# EAGLE design Audio Cape Guitar Conversion (EAGLE 6.6.0)
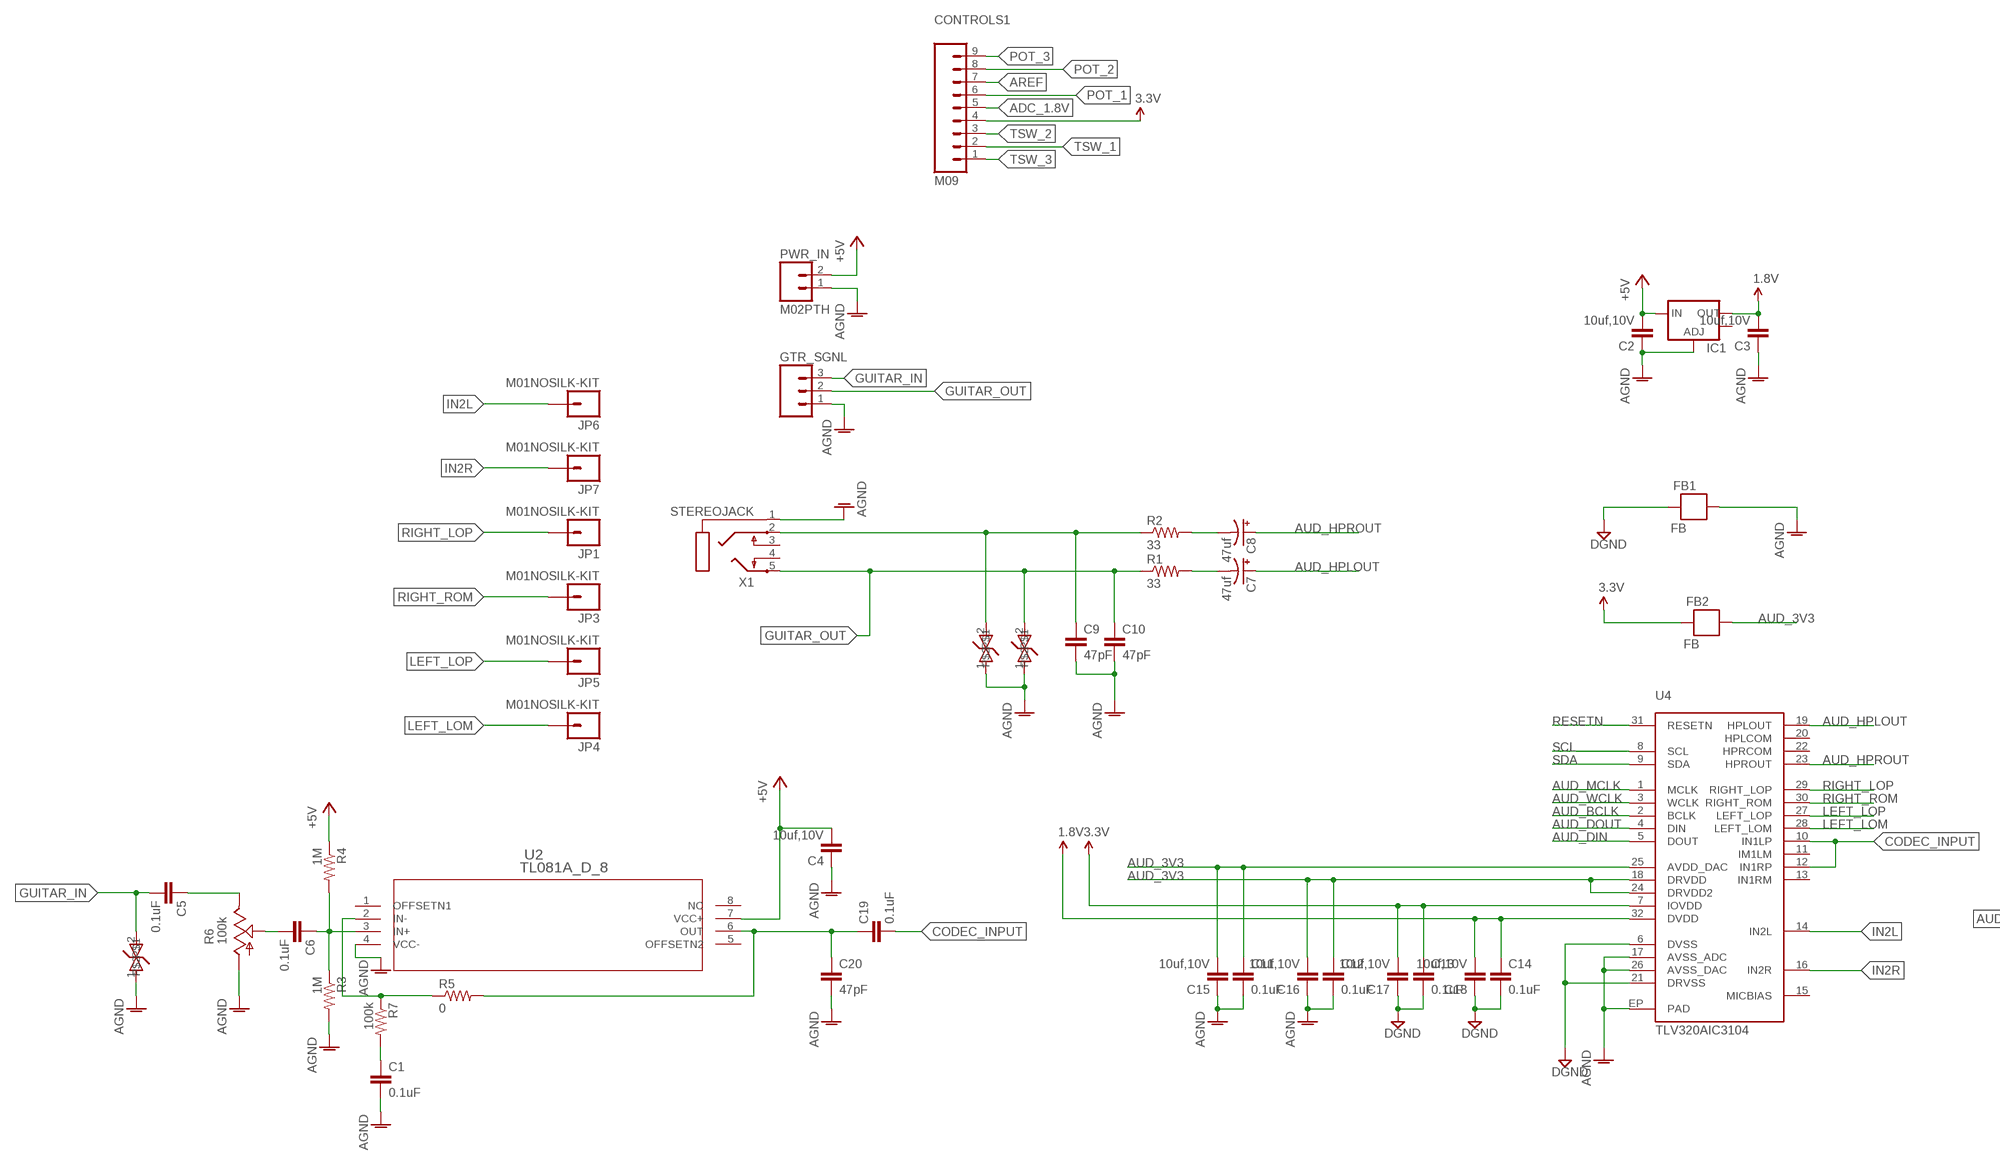
[diagram p0: schematic, sheet 1, part 1 of 2]
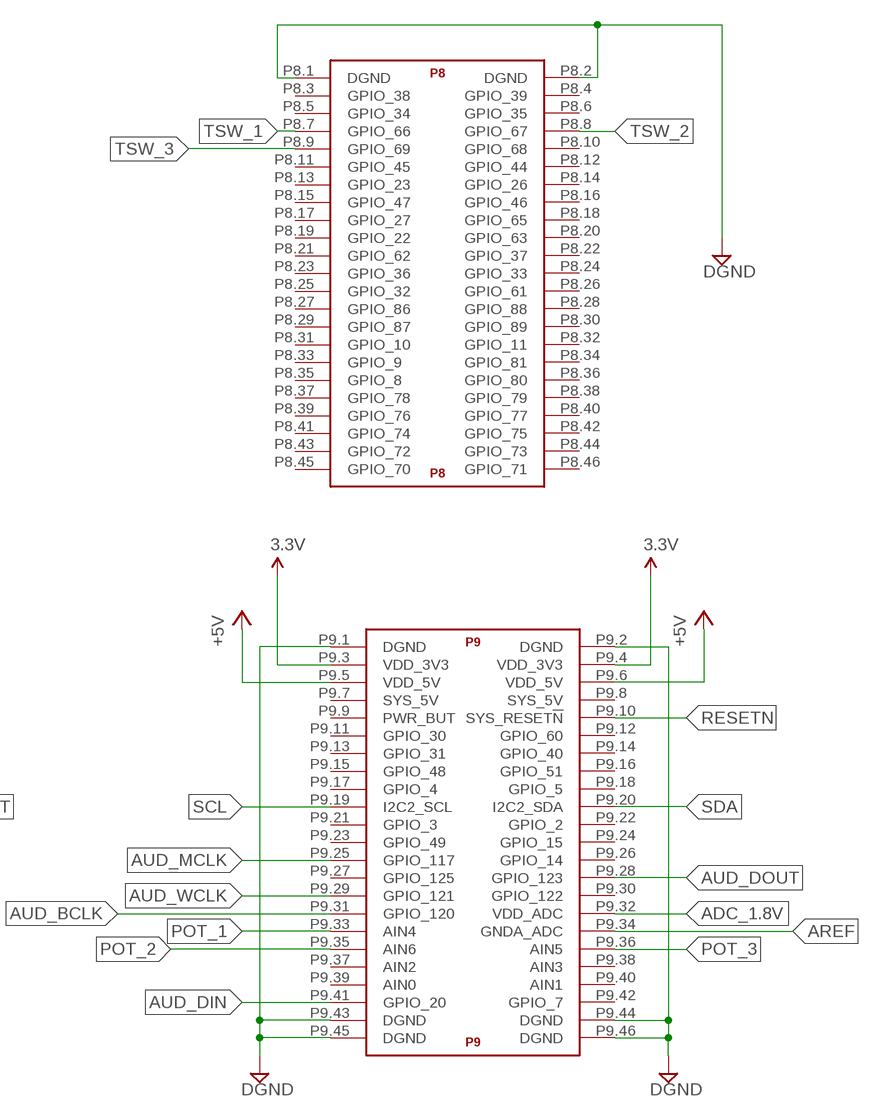
[diagram p1: schematic, sheet 1, part 2 of 2]

## Parts
C1  0.1uF  0.1UF-25V-5%(0603)  [0603-CAP]
C2  10uf,10V  CAP0603-CAP  [0603-CAP]
C3  10uf,10V  CAP0603-CAP  [0603-CAP]
C4  10uf,10V  CAP0603-CAP  [0603-CAP]
C5  0.1uF  0.1UF-25V-5%(0603)  [0603-CAP]
C6  0.1uF  0.1UF-25V-5%(0603)  [0603-CAP]
C7  47uf  CAP_POL1206  [EIA3216]
C8  47uf  CAP_POL1206  [EIA3216]
C9  47pF  CAP0402-CAP  [0402-CAP]
C10  47pF  CAP0402-CAP  [0402-CAP]
C11  0.1uF  0.1UF-25V-5%(0603)  [0603-CAP]
C12  0.1uF  0.1UF-25V-5%(0603)  [0603-CAP]
C13  0.1uF  0.1UF-25V-5%(0603)  [0603-CAP]
C14  0.1uF  0.1UF-25V-5%(0603)  [0603-CAP]
C15  10uf,10V  CAP0603-CAP  [0603-CAP]
C16  10uf,10V  CAP0603-CAP  [0603-CAP]
C17  10uf,10V  CAP0603-CAP  [0603-CAP]
C18  10uf,10V  CAP0603-CAP  [0603-CAP]
C19  0.1uF  0.1UF-25V-5%(0603)  [0603-CAP]
C20  47pF  CAP0402-CAP  [0402-CAP]
CONTROLS1  M09  [1X09]
D1  PGB0010603MR  [0603]
D2  PGB0010603MR  [0603]
D3  PGB0010603MR  [0603]
FB1  FB  [0603]
FB2  FB  [0603]
GTR_SGNL  M03PTH  [1X03]
IC1  V_REG_LM1117SOT223  [SOT223]
JP1  M01NOSILK-KIT  [1X01NS-KIT]
JP3  M01NOSILK-KIT  [1X01NS-KIT]
JP4  M01NOSILK-KIT  [1X01NS-KIT]
JP5  M01NOSILK-KIT  [1X01NS-KIT]
JP6  M01NOSILK-KIT  [1X01NS-KIT]
JP7  M01NOSILK-KIT  [1X01NS-KIT]
PWR_IN  M02PTH  [1X02]
R1  33  RESISTOR1206  [1206]
R2  33  RESISTOR1206  [1206]
R3  1M  RESISTOR1206  [1206]
R4  1M  RESISTOR1206  [1206]
R5  0  RESISTORPTH-1/4W  [AXIAL-0.4]
R6  100k  TRIM_US-S64Y  [S64Y]
R7  100k  RESISTOR1206  [1206]
U2  TL081A_D_8  [D8]
U4  TLV320AIC3104  [QFN-32]
U$1  BEAGLE_BONE_BLACK_CAPE  [BEAGLE_BONE_BLACK_CAPE]
X1  STEREOJACK  [STX3100]

## Nets
1.8V: C3.2 C14.1 C18.2 IC1.2(OUT) U4.32(DVDD)
3.3V: C13.1 C17.2 CONTROLS1.4 FB2.2 U4.7(IOVDD) U$1.P9.3(P9:VDD_3V3) U$1.P9.4(P9:VDD_3V3)
+5V: C2.2 C4.2 IC1.3(IN) PWR_IN.2 R4.1 U2.7(VCC+) U$1.P9.5(P9:VDD_5V) U$1.P9.6(P9:VDD_5V)
ADC_1.8V: CONTROLS1.5 U$1.P9.32(P9:VDD_ADC)
AGND: C1.2 C2.1 C3.1 C4.1 C9.2 C10.2 C11.2 C12.2 C15.1 C16.1 C20.2 D1.1 D2.1 D3.1 FB1.1 GTR_SGNL.1 IC1.1(ADJ) PWR_IN.1 R3.2 R6.A U2.4(VCC-) U4.17(AVSS_ADC) U4.26(AVSS_DAC) U4.EP(PAD) X1.1
AREF: CONTROLS1.7 U$1.P9.34(P9:GNDA_ADC)
AUD_3V3: C11.1 C12.1 C15.2 C16.2 FB2.1 U4.18(DRVDD) U4.24(DRVDD2) U4.25(AVDD_DAC)
AUD_BCLK: U4.2(BCLK) U$1.P9.31(P9:GPIO_120)
AUD_DIN: U4.5(DOUT) U$1.P9.41(P9:GPIO_20)
AUD_DOUT: U4.4(DIN) U$1.P9.28(P9:GPIO_123)
AUD_HPLOUT: C7.A(+) U4.19(HPLOUT)
AUD_HPROUT: C8.A(+) U4.23(HPROUT)
AUD_MCLK: U4.1(MCLK) U$1.P9.25(P9:GPIO_117)
AUD_WCLK: U4.3(WCLK) U$1.P9.29(P9:GPIO_121)
CODEC_INPUT: C19.2 U4.10(IN1LP) U4.12(IN1RP)
DGND: C13.2 C14.2 C17.1 C18.1 FB1.2 U4.6(DVSS) U4.21(DRVSS) U$1.P8.1(P8:DGND) U$1.P8.2(P8:DGND) U$1.P9.1(P9:DGND) U$1.P9.2(P9:DGND) U$1.P9.43(P9:DGND) U$1.P9.44(P9:DGND) U$1.P9.45(P9:DGND) U$1.P9.46(P9:DGND)
GUITAR_IN: C5.2 D3.2 GTR_SGNL.3
GUITAR_OUT: C10.1 D2.2 GTR_SGNL.2 R1.1 X1.5
IN2L: JP6.1 U4.14(IN2L)
IN2R: JP7.1 U4.16(IN2R)
LEFT_LOM: JP4.1 U4.28(LEFT_LOM)
LEFT_LOP: JP5.1 U4.27(LEFT_LOP)
N$1: C7.C(-) R1.2
N$2: C5.1 R6.E
N$4: C6.1 R3.1 R4.2 U2.3(IN+)
N$5: C1.1 R7.2
N$6: C8.C(-) R2.2
N$7: R5.P$1 R7.1 U2.2(IN-)
N$8: C19.1 C20.1 R5.P$2 U2.6(OUT)
N$78: C6.2 R6.S
OUTR: C9.1 D1.2 R2.1 X1.2
POT_1: CONTROLS1.6 U$1.P9.33(P9:AIN4)
POT_2: CONTROLS1.8 U$1.P9.35(P9:AIN6)
POT_3: CONTROLS1.9 U$1.P9.36(P9:AIN5)
RESETN: U4.31(RESETN) U$1.P9.10(P9:SYS_RESET!N)
RIGHT_LOP: JP1.1 U4.29(RIGHT_LOP)
RIGHT_ROM: JP3.1 U4.30(RIGHT_ROM)
SCL: U4.8(SCL) U$1.P9.19(P9:I2C2_SCL)
SDA: U4.9(SDA) U$1.P9.20(P9:I2C2_SDA)
TSW_1: CONTROLS1.2 U$1.P8.7(P8:GPIO_66)
TSW_2: CONTROLS1.3 U$1.P8.8(P8:GPIO_67)
TSW_3: CONTROLS1.1 U$1.P8.9(P8:GPIO_69)
Unconnected: IC1.4(OUT) U2.1(OFFSETN1) U2.5(OFFSETN2) U2.8(NC) U4.11(IM1LM) U4.13(IN1RM) U4.15(MICBIAS) U4.20(HPLCOM) U4.22(HPRCOM) U$1.P8.3(P8:GPIO_38) U$1.P8.4(P8:GPIO_39) U$1.P8.5(P8:GPIO_34) U$1.P8.6(P8:GPIO_35) U$1.P8.10(P8:GPIO_68) U$1.P8.11(P8:GPIO_45) U$1.P8.12(P8:GPIO_44) U$1.P8.13(P8:GPIO_23) U$1.P8.14(P8:GPIO_26) U$1.P8.15(P8:GPIO_47) U$1.P8.16(P8:GPIO_46) U$1.P8.17(P8:GPIO_27) U$1.P8.18(P8:GPIO_65) U$1.P8.19(P8:GPIO_22) U$1.P8.20(P8:GPIO_63) U$1.P8.21(P8:GPIO_62) U$1.P8.22(P8:GPIO_37) U$1.P8.23(P8:GPIO_36) U$1.P8.24(P8:GPIO_33) U$1.P8.25(P8:GPIO_32) U$1.P8.26(P8:GPIO_61) U$1.P8.27(P8:GPIO_86) U$1.P8.28(P8:GPIO_88) U$1.P8.29(P8:GPIO_87) U$1.P8.30(P8:GPIO_89) U$1.P8.31(P8:GPIO_10) U$1.P8.32(P8:GPIO_11) U$1.P8.33(P8:GPIO_9) U$1.P8.34(P8:GPIO_81) U$1.P8.35(P8:GPIO_8) U$1.P8.36(P8:GPIO_80) U$1.P8.37(P8:GPIO_78) U$1.P8.38(P8:GPIO_79) U$1.P8.39(P8:GPIO_76) U$1.P8.40(P8:GPIO_77) U$1.P8.41(P8:GPIO_74) U$1.P8.42(P8:GPIO_75) U$1.P8.43(P8:GPIO_72) U$1.P8.44(P8:GPIO_73) U$1.P8.45(P8:GPIO_70) U$1.P8.46(P8:GPIO_71) U$1.P9.7(P9:SYS_5V) U$1.P9.8(P9:SYS_5V) U$1.P9.9(P9:PWR_BUT) U$1.P9.11(P9:GPIO_30) U$1.P9.12(P9:GPIO_60) U$1.P9.13(P9:GPIO_31) U$1.P9.14(P9:GPIO_40) U$1.P9.15(P9:GPIO_48) U$1.P9.16(P9:GPIO_51) U$1.P9.17(P9:GPIO_4) U$1.P9.18(P9:GPIO_5) U$1.P9.21(P9:GPIO_3) U$1.P9.22(P9:GPIO_2) U$1.P9.23(P9:GPIO_49) U$1.P9.24(P9:GPIO_15) U$1.P9.26(P9:GPIO_14) U$1.P9.27(P9:GPIO_125) U$1.P9.30(P9:GPIO_122) U$1.P9.37(P9:AIN2) U$1.P9.38(P9:AIN3) U$1.P9.39(P9:AIN0) U$1.P9.40(P9:AIN1) U$1.P9.42(P9:GPIO_7) X1.3 X1.4

## Library data of the parts
C1 C5 C6 = SparkFun-Capacitors:0.1UF-25V-5%(0603): CAP-08604; PROD_ID: CAP-08604
C2-C4 C15-C18 = SparkFun-Passives:CAP: Capacitor Standard 0603 ceramic capacitor, and 0.1" leaded capacitor.; MANEX: 123-0001127
C7 C8 = SparkFun-Capacitors:CAP_POL: Capacitor Polarized These are standard SMD and PTH capacitors. Normally 10uF, 47uF, and 100uF in electrolytic and tantalum varieties. Always verify the external diameter of the through hole cap, it varies with capacity, voltage, and manufacturer. The EIA devices should be standard.; MANEX: 123-0001196
C9 C10 C20 = SparkFun-Passives:CAP: Capacitor Standard 0603 ceramic capacitor, and 0.1" leaded capacitor.; MANEX: 123-0001115
C11-C14 = SparkFun-Capacitors:0.1UF-25V-5%(0603): CAP-08604; MANEX: 123-0001056; PROD_ID: CAP-08604
C19 = SparkFun-Capacitors:0.1UF-25V-5%(0603): CAP-08604; MANEX: 123-0001032; PROD_ID: CAP-08604
CONTROLS1 = SparkFun-Connectors:M09: Header 9 Standard 9-pin 0.1" header. Use with straight break away headers (SKU : PRT-00116), right angle break away headers (PRT-00553), swiss pins (PRT-00743), machine pins (PRT-00117), and female headers (PRT-00115).
D1-D3 = CircuitCo:PGB0010603MR; MANEX: 130-0001371
FB1 FB2 = SparkFun-Passives:FB; MANEX: 126-0001418
GTR_SGNL = SparkFun-Connectors:M03: Header 3 Standard 3-pin 0.1" header. Use with straight break away headers (SKU : PRT-00116), right angle break away headers (PRT-00553), swiss pins (PRT-00743), machine pins (PRT-00117), and female headers (PRT-00115). Molex polarized connector foot print use with SKU : PRT-08232 with associated crimp pins and housings.
IC1 = SparkFun-PowerIC:V_REG_LM1117: Voltage Regulator LM1117 Standard adjustable voltage regulator but in SMD form. Spark Fun Electronics SKU : COM-00595
JP1 JP3-JP7 = SparkFun-Connectors:M01: Header 1 Standard 1-pin 0.1" header. Use with straight break away headers (SKU : PRT-00116), right angle break away headers (PRT-00553), swiss pins (PRT-00743), machine pins (PRT-00117), and female headers (PRT-00115).
PWR_IN = SparkFun-Connectors:M02: Standard 2-pin 0.1" header. Use with - straight break away headers ( PRT-00116) - right angle break away headers (PRT-00553) - swiss pins (PRT-00743) - machine pins (PRT-00117) - female headers (PRT-00115) Molex polarized connector foot print use with: PRT-08233 with associated crimp pins and housings. 2.54_SCREWTERM for use with PRT-10571. 3.5mm Screw Terminal footprints for PRT-08084 5mm Screw Terminal footprints for use with PRT-08432
R1 R2 = SparkFun-Resistors:RESISTOR: Resistor Basic schematic elements and footprints for 0603, 1206, and PTH resistors.; MANEX: 110-0002014
R3 R4 R7 = SparkFun-Resistors:RESISTOR: Resistor Basic schematic elements and footprints for 0603, 1206, and PTH resistors.
R5 = SparkFun-Passives:RESISTOR: Resistor Basic schematic elements and footprints for 0603, 1206, and PTH resistors.
R6 = pot:TRIM_US-: POTENTIOMETER
U2 = TL081A:TL081A_D_8; DATASHEETURL: http://www.ti.com/lit/gpn/TL081A; DESCRIPTION: JFET-Input Operational Amplifier; FAMILY_NAME: STANDARD LINEAR AMPLIFIER; GENERIC_PART_NUMBER: TL081A; INDUSTRY_STD_PKG_TYPE: SOIC; MANUFACTURER: Texas Instruments; MANUFACTURER_PART_NUMBER: tl081a_d_8; PACKAGE_DESIGNATOR: D; PIN_COUNT: 8; VENDOR: Texas Instruments
U4 = CircuitCo:TLV320AIC3104; MANEX: 140-0004277
U$1 = SparkFun-Boards:BEAGLE_BONE_BLACK_CAPE
X1 = adafruit:STEREOJACK: MIC/HEADPHONE JACK Stereo jack with two switches. Kycon STX3100, CUI SJ1-3555NG and/or 4UCon 05544

## Board
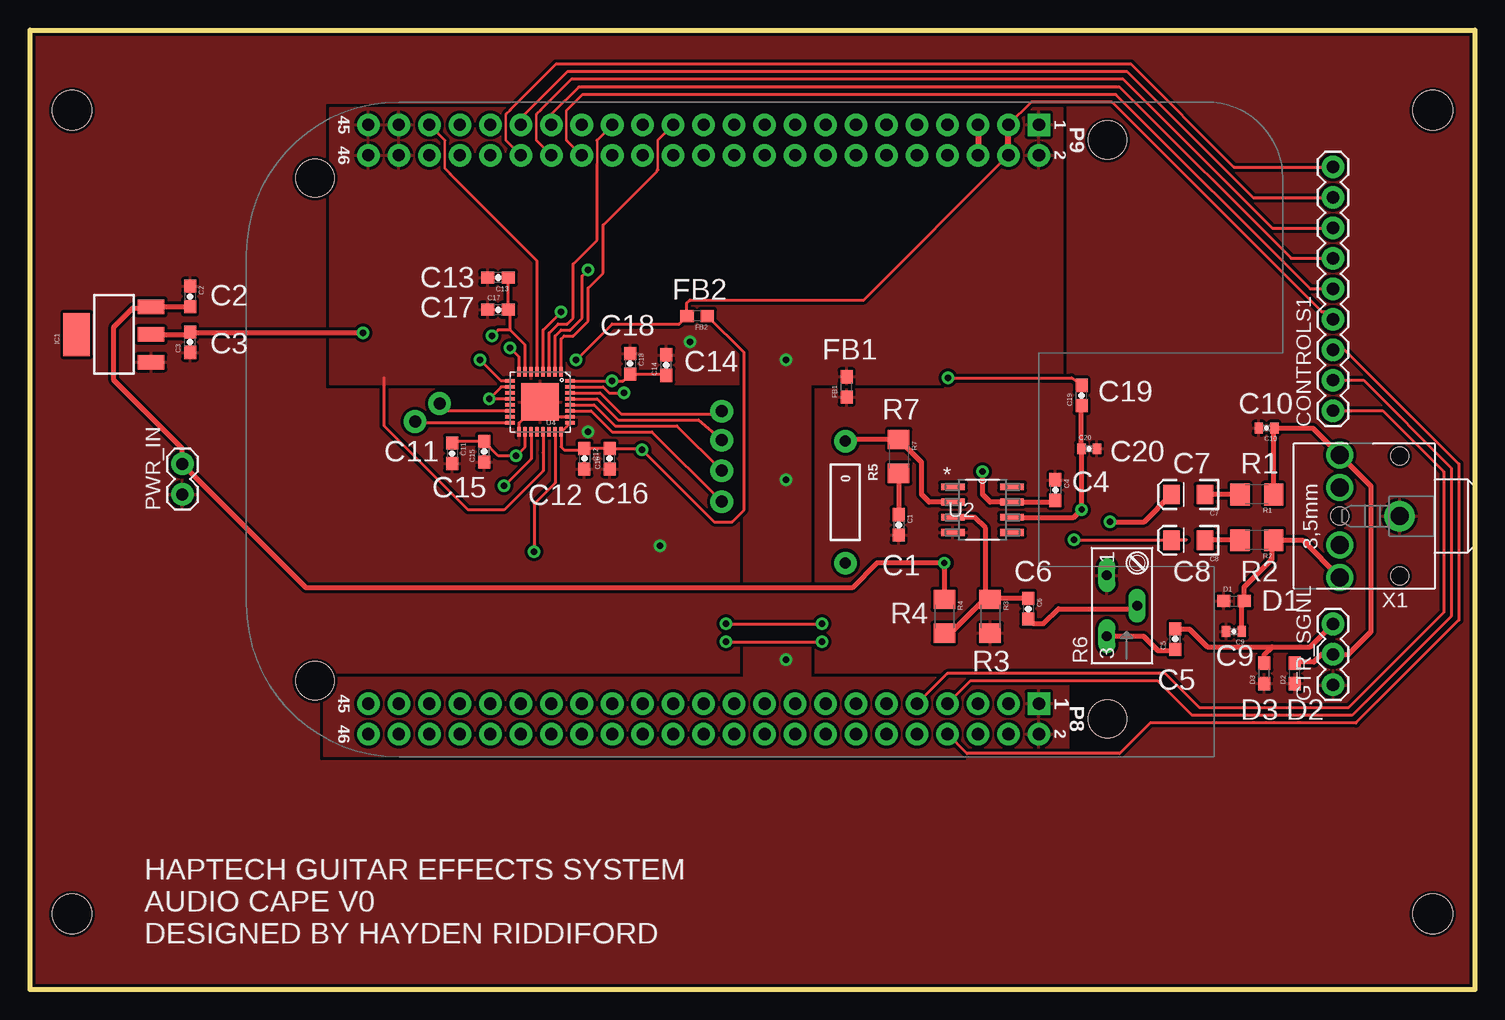
[diagram p2: board, top side]
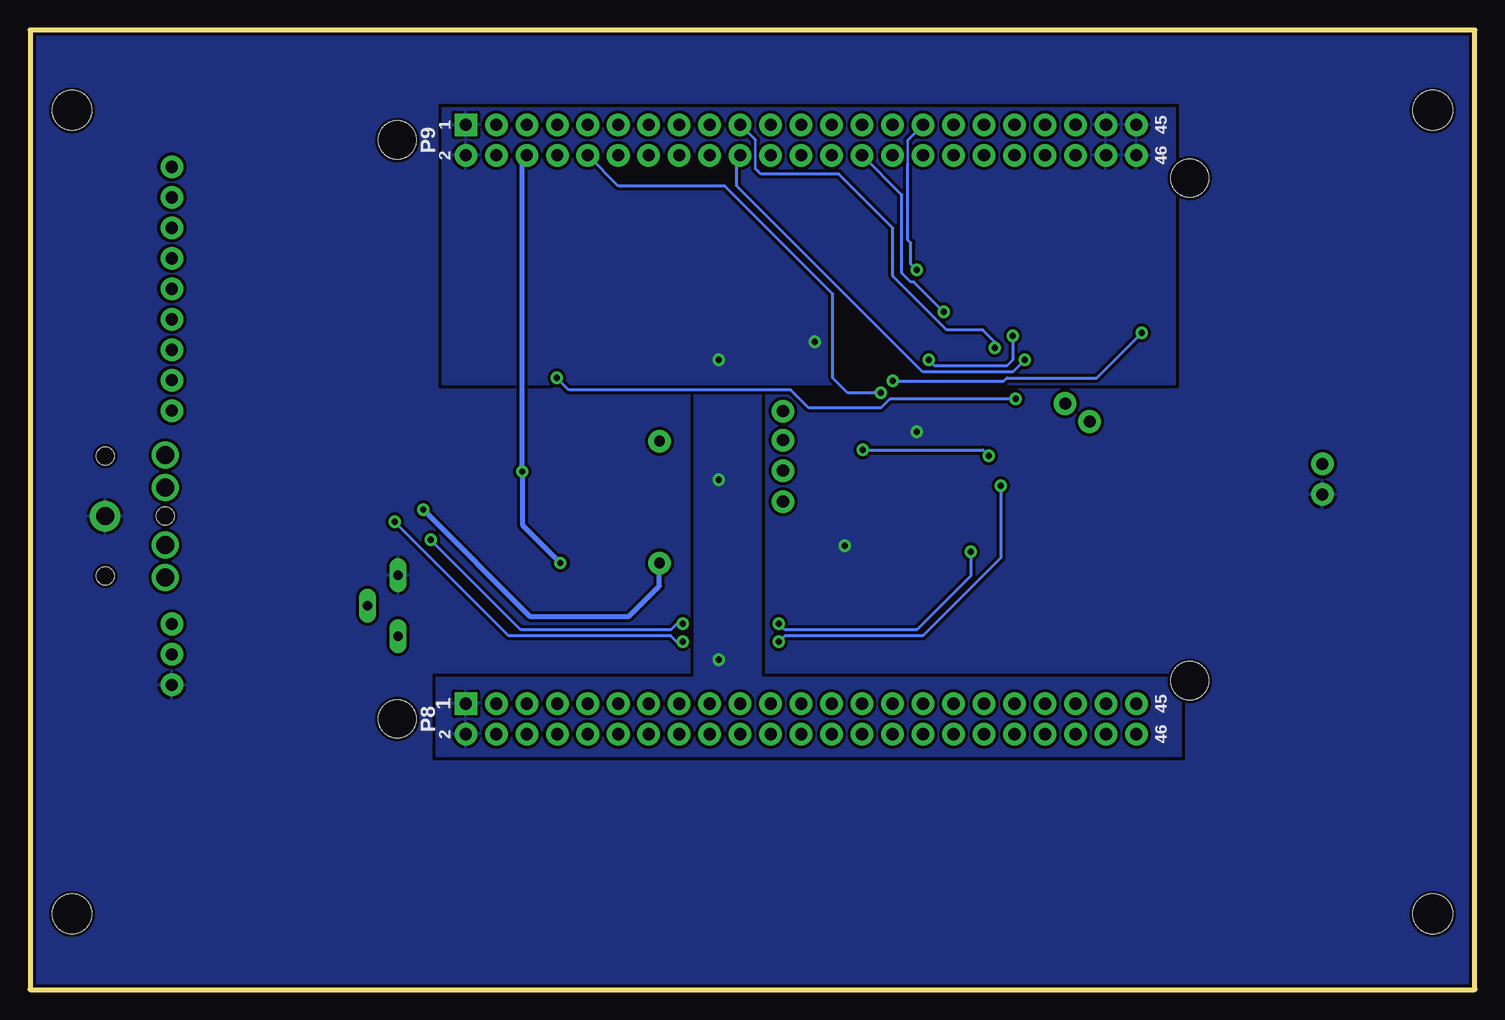
[diagram p3: board, bottom side, seen from below]

Size 120.4 x 80 mm. Coordinates in mm from the lower left corner, seen from the top.
Outline: 0,0 0,80 120.4,80 120.4,0 0,0
Copper layers (1*16): Top 0.035mm / dielectric 1.5mm / Bottom 0.035mm
Design rules "SparkFun": minimum track width 8mil, minimum drill 20mil, track to track 8mil, track to pad 8mil, pad to pad 8mil, via to via 8mil, smd to smd 8mil, copper to edge 10mil, drill to drill 8mil, minimum pad ring 12mil, minimum via ring 10mil, stop-mask expansion 4mil, vias tented up to drill 25mil, thermal gap 10mil
Holes 3.3 mm at 116.9,73.3 3.5,73.3 116.9,6.3 3.5,6.3

### Footprints (pad centres in the part's own frame; a part is rotated, then mirrored left to right if it is on the bottom)
0603-CAP = smd 1.1 x 1: 1 -0.85,0; 2 0.85,0
EIA3216 = smd 1.4 x 1.6: A 1.4,0; C -1.4,0
0402-CAP = smd 0.7 x 0.9: 1 -0.65,0; 2 0.65,0
1X09 = drill 1.016 pad 1.88: 1 0,0; 2 2.54,0; 3 5.08,0; 4 7.62,0; 5 10.16,0; 6 12.7,0; 7 15.24,0; 8 17.78,0; 9 20.32,0
0603 = smd 1.1 x 1: 1 -0.85,0; 2 0.85,0
1X03 = drill 1.016 pad 1.88: 1 0,0; 2 2.54,0; 3 5.08,0
SOT223 = smd 1.219 x 2.235: 1 -2.311,-3.099; 2 0,-3.099; 3 2.311,-3.099 | smd 3.6 x 2.2: 4 0,3.099
1X01NS-KIT = drill 1.016 pad 1.88: 1 0,0
1X02 = drill 1.016 pad 1.88: 1 0,0; 2 2.54,0
1206 = smd 1.6 x 1.8: 1 -1.4,0; 2 1.4,0
AXIAL-0.4 = drill 0.9 pad 1.88: P$1 -5.08,0; P$2 5.08,0
S64Y = drill 0.813 long: A 2.54,1.27; E -2.54,1.27; S 0,-1.27
D8 = smd 1.981 x 0.559: 1 -2.464,1.905; 2 -2.464,0.635; 3 -2.464,-0.635; 4 -2.464,-1.905; 5 2.464,-1.905; 6 2.464,-0.635; 7 2.464,0.635; 8 2.464,1.905
QFN-32 = smd 0.285 x 0.8: 1 -1.75,-2.5; 2 -1.25,-2.5; 3 -0.75,-2.5; 4 -0.25,-2.5; 5 0.25,-2.5; 6 0.75,-2.5; 7 1.25,-2.5; 8 1.75,-2.5; 17 1.75,2.5; 18 1.25,2.5; 19 0.75,2.5; 20 0.25,2.5; 21 -0.25,2.5; 22 -0.75,2.5; 23 -1.25,2.5; 24 -1.75,2.5 | smd 0.8 x 0.285: 9 2.5,-1.75; 10 2.5,-1.25; 11 2.5,-0.75; 12 2.5,-0.25; 13 2.5,0.25; 14 2.5,0.75; 15 2.5,1.25; 16 2.5,1.75; 25 -2.5,1.75; 26 -2.5,1.25; 27 -2.5,0.75; 28 -2.5,0.25; 29 -2.5,-0.25; 30 -2.5,-0.75; 31 -2.5,-1.25; 32 -2.5,-1.75 | smd 3.15 x 3.15: EP 0,0
BEAGLE_BONE_BLACK_CAPE = drill 1.016 pad 1.88 square: P8.1 20.32,50.165; P9.1 20.32,1.905 | drill 1.016 pad 1.88: P8.2 20.32,52.705; P8.3 22.86,50.165; P8.4 22.86,52.705; P8.5 25.4,50.165; P8.6 25.4,52.705; P8.7 27.94,50.165; P8.8 27.94,52.705; P8.9 30.48,50.165; P8.10 30.48,52.705; P8.11 33.02,50.165; P8.12 33.02,52.705; P8.13 35.56,50.165; P8.14 35.56,52.705; P8.15 38.1,50.165; P8.16 38.1,52.705; P8.17 40.64,50.165; P8.18 40.64,52.705; P8.19 43.18,50.165; P8.20 43.18,52.705; P8.21 45.72,50.165; P8.22 45.72,52.705; P8.23 48.26,50.165; P8.24 48.26,52.705; P8.25 50.8,50.165; P8.26 50.8,52.705; P8.27 53.34,50.165; P8.28 53.34,52.705; P8.29 55.88,50.165; P8.30 55.88,52.705; P8.31 58.42,50.165; P8.32 58.42,52.705; P8.33 60.96,50.165; P8.34 60.96,52.705; P8.35 63.5,50.165; P8.36 63.5,52.705; P8.37 66.04,50.165; P8.38 66.04,52.705; P8.39 68.58,50.165; P8.40 68.58,52.705; P8.41 71.12,50.165; P8.42 71.12,52.705; P8.43 73.66,50.165; P8.44 73.66,52.705; P8.45 76.2,50.165; P8.46 76.2,52.705; P9.2 20.32,4.445; P9.3 22.86,1.905; P9.4 22.86,4.445; P9.5 25.4,1.905; P9.6 25.4,4.445; P9.7 27.94,1.905; P9.8 27.94,4.445; P9.9 30.48,1.905; P9.10 30.48,4.445; P9.11 33.02,1.905; P9.12 33.02,4.445; P9.13 35.56,1.905; P9.14 35.56,4.445; P9.15 38.1,1.905; P9.16 38.1,4.445; P9.17 40.64,1.905; P9.18 40.64,4.445; P9.19 43.18,1.905; P9.20 43.18,4.445; P9.21 45.72,1.905; P9.22 45.72,4.445; P9.23 48.26,1.905; P9.24 48.26,4.445; P9.25 50.8,1.905; P9.26 50.8,4.445; P9.27 53.34,1.905; P9.28 53.34,4.445; P9.29 55.88,1.905; P9.30 55.88,4.445; P9.31 58.42,1.905; P9.32 58.42,4.445; P9.33 60.96,1.905; P9.34 60.96,4.445; P9.35 63.5,1.905; P9.36 63.5,4.445; P9.37 66.04,1.905; P9.38 66.04,4.445; P9.39 68.58,1.905; P9.40 68.58,4.445; P9.41 71.12,1.905; P9.42 71.12,4.445; P9.43 73.66,1.905; P9.44 73.66,4.445; P9.45 76.2,1.905; P9.46 76.2,4.445 | hole 3.175: 14.605,3.175; 80.645,6.35; 80.645,48.26; 14.605,51.435
STX3100 = drill 1.5 pad 2.54: 1 2.7,-0.1 | drill 1.5: 2 7.7,5; 3 7.7,2.3; 4 7.7,-2.5; 5 7.7,-5.2 | hole 1.5: 2.7,4.9; 2.7,-5.1; 7.7,-0.1

### Placement (x,y rotation side)
C1  72.39,38.73 270 top
C2  13.34,57.78 270 top
C3  13.34,53.98 90 top
C4  85.45,41.65 270 top
C5  95.44,29.21 90 top
C6  83.19,31.75 270 top
C7  96.52,41.27 180 top
C8  96.52,37.47 180 top
C9  100.33,29.84 180 top
C10  103.05,46.81 180 top
C11  35.17,44.7 270 top
C12  46.2,44.26 270 top
C13  39,59.35 180 top
C14  53.02,52.06 90 top
C15  37.85,44.84 90 top
C16  48.3,44.26 90 top
C17  39,56.67 0 top
C18  50.01,52.17 270 top
C19  87.63,49.53 90 top
C20  88.27,45.09 0 top
CONTROLS1  108.58,48.26 90 top
D1  100.33,32.38 0 top
D2  105.41,26.35 90 top
D3  102.87,26.35 90 top
FB1  68.06,50.24 90 top
FB2  55.59,56.16 180 top
GTR_SGNL  108.58,25.4 90 top
IC1  6.99,54.61 90 top
JP1  57.65,45.8 90 top
JP3  57.65,48.22 90 top
JP4  57.65,43.26 90 top
JP5  57.65,40.68 90 top
JP6  34.14,48.85 0 top
JP7  32.1,47.35 0 top
PWR_IN  12.7,41.27 90 top
R1  102.23,41.27 180 top
R2  102.23,37.47 180 top
R3  80.01,31.11 270 top
R4  76.2,31.11 270 top
R5  67.94,40.64 270 top
R6  91,32 90 top
R7  72.39,44.45 270 top
U2  79.38,40.01 0 top
U4  42.5,49 180 top
U$1  104.4,74 180 top
X1  116.84,39.37 180 top

### Tracks (layer width: path | path; a pad name or v marks a point on that pad's centre or on a via)
1.8V  (via drill 0.51)
  Top 0.254: U4.32 v48.5,50.75 49.44,50.75 C18.2 52.93,51.32 C14.1
  Top 0.406: IC1.2 13.12,54.61 C3.2 13.41,54.75 v27.75,54.75
  Bottom 0.254: v48.5,50.75 39.25,50.75 39,51 31.5,51 v27.75,54.75
3.3V  (via drill 0.51)
  Top 0.203: 39.85,59.15 C13.1
  Top 0.254: 39.75,56.58 C17.2 | U4.7 41.25,53.75 40,55 | 40,55 40,56.52 C17.2 | 40,55 39,55 v38.5,54.5 | v45.5,52.5 48.5,55.5 54.09,55.5 FB2.2 54.74,57.24 55,57.5 69.48,57.5 U$1.P9.4 | U$1.P9.3 83.42,73.98 90.17,73.98 107.63,56.52 107.95,56.52 CONTROLS1.4 | C17.2 39.85,59.15
  Top 0.508: U$1.P9.4 U$1.P9.3
  Bottom 0.254: v38.5,54.5 38.5,52.5 39,52 45,52 v45.5,52.5
+5V  (via drill 0.51)
  Top 0.406: C2.2 13.32,56.92 IC1.3 9.99,56.83 8.57,56.83 6.99,55.24 6.99,50.8 12.7,45.09 PWR_IN.2 23.02,33.5 68.5,33.5 70.56,35.56 v76.2,35.56 R4.1 | v79.38,43.18 79.38,41.27 80.01,40.64 U2.7 85.3,40.64 C4.2
  Top 0.508: U$1.P9.5 U$1.P9.6
  Bottom 0.406: v76.2,35.56 79.38,38.73 v79.38,43.18 79.38,69.18 U$1.P9.6
ADC_1.8V
  Top 0.203: 44.7,73.28 44.7,70.83
  Top 0.254: 44.7,73.28 46.04,74.61 90.49,74.61 106.68,58.42 CONTROLS1.5 | 44.7,70.83 U$1.P9.32
AGND  (via drill 0.51)
  Top 0.254: U4.26 43.75,47.75 U4.EP 40.75,47.25 U4.17
  other vias: 52.5,37 46.5,46.5
  pour Top (isolate 0.254, rank 2): -1,80.5 -1,-1 121.5,-1 121.5,81 -1,81
  pour Bottom (isolate 0.254, rank 2): -0.64,80.64 121.28,80.64 121.28,-0.64 -0.64,-0.64
AREF
  Top 0.203: 42.19,72.97 42.19,70.81
  Top 0.254: CONTROLS1.7 103.5,63.5 91.12,75.88 45.09,75.88 42.55,73.34 42.55,73.33 42.19,72.97 | 42.19,70.81 U$1.P9.34
AUD_3V3  (via drill 0.51)
  Top 0.254: 48.41,45 C16.2 | C16.2 46.41,45.1 C12.1 | C12.1 45.84,44.91 | U4.25 U4.24 44.25,45.25 44.5,45 46.11,45 C12.1 | U4.18 41.25,45.25 v40.5,44.5 39.04,44.5 C15.2 35.51,45.69 C11.1 | C16.2 50.9,45.1 v51,45 57,39 58.5,39 59.5,40 59.5,53.1 FB2.1
  Bottom 0.254: v51,45 41,45 v40.5,44.5
AUD_BCLK  (via drill 0.51)
  Top 0.254: U4.2 43.75,54.5 44.25,55 45,55 46,56 46,59.5 v46.5,60
  Bottom 0.203: 47.25,68.83 47.25,70.79
  Bottom 0.254: v46.5,60 47,60.5 47,62.25 47.25,62.5 47.25,68.83 | 47.25,70.79 47.25,70.83 U$1.P9.31
AUD_DIN
  Top 0.203: 34.57,68.46 34.57,70.81
  Top 0.254: U4.5 42.25,60.75 35,68 35,68.03 34.57,68.46 | 34.57,70.81 U$1.P9.41
AUD_DOUT  (via drill 0.51)
  Top 0.254: U4.4 42.75,55 v44.25,56.5
  Bottom 0.254: v44.25,56.5 46.75,59 47,59 47.75,59.75 47.75,66.25 U$1.P9.28
AUD_HPLOUT  (via drill 0.51)
  Top 0.254: U4.19 41.75,44.25 v39.5,42 | v58,29 v66,29
  Top 0.406: v90,39 92.84,39 C7.A
  Bottom 0.254: v39.5,42 39.5,36 46,29.5 57.5,29.5 v58,29 | v90,39 80.5,29.5 67,29.5 66.5,29 v66,29
AUD_HPROUT  (via drill 0.51)
  Top 0.254: U4.23 43.75,42.25 42,40.5 v42,36.5 | v87,37.5 96.36,37.5 C8.A | v58,30.5 v66,30.5
  Bottom 0.254: v42,36.5 42,34.5 46.5,30 57.5,30 v58,30.5 | v87,37.5 79.5,30 67,30 66.5,30.5 v66,30.5
AUD_MCLK
  Top 0.203: 52.33,68.34 52.33,70.83
  Top 0.254: U4.1 44.25,54.25 44.5,54.5 45.25,54.5 46.5,55.75 46.5,58.5 47.75,59.75 47.75,63.75 52.25,68.25 52.25,68.26 52.33,68.34 | 52.33,70.83 U$1.P9.25
AUD_WCLK
  Top 0.203: 47.25,68.83 47.25,70.74
  Top 0.254: U4.3 43.25,54.75 44,55.5 44.75,55.5 45.25,56 45.25,60.5 47.25,62.5 47.25,68.83 | 47.25,70.74 47.25,70.83 U$1.P9.29
CODEC_INPUT  (via drill 0.51)
  Top 0.254: U4.12 v38.27,49.25 39.27,50.25 U4.10 | v76.5,51 86.81,51 C19.2
  Bottom 0.254: v38.27,49.25 48.75,49.25 49.5,48.5 55.5,48.5 57,50 75.5,50 v76.5,51
DGND  (via drill 0.51)
  Top 0.254: 42.75,44.75 U4.21 42.75,43.25 39.5,40 36.5,40 29.5,47 29.5,51
  other vias: 55,54 63,52.5 63,42.5 63,27.5
  pour Top (isolate 0.254): 25,50.5 59.5,50.5 59.5,26 24.5,26 24.5,19.5 86.5,19.5 86.5,26 65,26 65,50.5 86,50.5 86,73.5 25,73.5
  pour Bottom (isolate 0.254): 25,73.5 86,73.5 86,50.5 65,50.5 65,26 86.5,26 86.5,19.5 24.5,19.5 24.5,26 59.5,26 59.5,50.5 25,50.5
GUITAR_IN
  Top 0.406: C5.2 96.62,30.06 98.11,28.57 103.5,28.57 | 103.5,28.57 106.68,28.57 GTR_SGNL.3 | D3.2 102.87,27.94 103.5,28.57
GUITAR_OUT
  Top 0.406: R1.1 103.64,46.74 C10.1 106.9,46.81 X1.5 111.76,41.95 111.76,29.84 109.86,27.94 GTR_SGNL.2 107.63,27.94 107,27.3 105.51,27.3 D2.2
IN2L
  Top 0.254: U4.14 34.74,48.25 JP6.1
IN2R
  Top 0.254: U4.16 32.2,47.25 JP7.1
LEFT_LOM
  Top 0.254: U4.28 47,48.75 48.75,47 53.91,47 JP4.1
LEFT_LOP
  Top 0.254: U4.27 46.75,48.25 48.5,46.5 51.83,46.5 JP5.1
N$1
  Top 0.406: R1.2 C7.C
N$2
  Top 0.406: R6.E 92.78,29.46 93.98,28.26 95.34,28.26 C5.1
N$4
  Top 0.406: C6.1 80.09,32.6 R3.1 79.64,32.52 | 79.64,32.52 79.64,38.48 78.74,39.37 U2.3 | 79.64,32.52 79.5,32.52 76.83,29.84 76.33,29.84 R4.2
N$5
  Top 0.406: R7.2 C1.1
N$6
  Top 0.406: R2.2 C8.C
N$7
  Top 0.406: U2.2 74.93,40.64 74.3,41.27 74.3,43.95 R7.1 68.08,45.85 R5.P$1
N$8  (via drill 0.51)
  Top 0.406: U2.6 87,39.37 v87.63,40.01 87.63,45.07 C20.1 87.61,48.87 C19.1
  Bottom 0.406: v87.63,40.01 78.74,31.11 70.48,31.11 67.94,33.66 R5.P$2
N$78
  Top 0.406: C6.2 83.61,30.48 84.45,30.48 85.72,31.75 92.02,31.75 R6.S
OUTR
  Top 0.406: C9.1 100.98,32.19 D1.2 101.18,33.55 103.5,35.88 103.5,37.34 R2.1 106.05,37.47 X1.2
POT_1
  Top 0.254: U$1.P9.33 43.5,72.15 43.5,73.03 45.72,75.25 90.81,75.25 105.09,60.96 CONTROLS1.6
POT_2
  Top 0.254: U$1.P9.35 40.96,72.15 40.96,72.71 44.77,76.52 91.44,76.52 101.92,66.04 CONTROLS1.8
POT_3
  Top 0.203: 39.65,72.97 39.65,70.81
  Top 0.254: CONTROLS1.9 100.33,68.58 91.76,77.15 43.81,77.15 40.01,73.34 40.01,73.33 39.65,72.97 | 39.65,70.81 U$1.P9.36
RESETN  (via drill 0.51)
  Top 0.254: U4.31 47.75,50.25 48.25,49.75 v49.5,49.75
  Bottom 0.254: U$1.P9.10 71.36,67 62.5,67 53.5,58 53.5,51 52.25,49.75 v49.5,49.75
RIGHT_LOP
  Top 0.254: U4.29 47.25,49.25 49,47.5 55.7,47.5 JP1.1
RIGHT_ROM
  Top 0.254: U4.30 47.5,49.75 49.25,48 57.62,48 JP3.1
SCL  (via drill 0.51)
  Top 0.254: U4.8 40.75,52.75 v40,53.5
  Bottom 0.203: 59.96,68.45 59.96,70.83
  Bottom 0.254: v40,53.5 40,54 41,55 44,55 48.5,59.5 48.5,63.5 53,68 59.5,68 59.75,68.25 59.76,68.25 59.96,68.45 | 59.96,70.83 U$1.P9.19
SDA  (via drill 0.51)
  Top 0.254: U4.9 39.25,50.75 v37.5,52.5
  Bottom 0.254: v37.5,52.5 38.5,51.5 46,51.5 61.5,67 61.5,69.28 U$1.P9.20
TSW_1
  Top 0.254: CONTROLS1.2 111.12,50.8 118.43,43.5 118.43,31.11 110.17,22.86 96.84,22.86 93.98,25.72 78.34,25.72 U$1.P8.7
TSW_2
  Top 0.254: CONTROLS1.3 109.54,53.34 119.06,43.81 119.06,30.8 110.49,22.23 93.34,22.23 90.81,19.68 78.07,19.68 U$1.P8.8
TSW_3
  Top 0.254: CONTROLS1.1 112.71,48.26 117.79,43.18 117.79,31.43 109.86,23.5 97.47,23.5 94.61,26.35 76.44,26.35 U$1.P8.9

### Text on the board
tPlace: C13 | FB2 | C2 | C17 | C18 | C3 | C14 | FB1 | C19 | R7 | C10 | C11 | C20 | C7 | R1 | C15 | C4 | C12 | C16 | C1 | C6 | C8 | R2 | D1 | R4 | C9 | R3 | C5 | D3 | D2 | HAPTECH GUITAR EFFECTS SYSTEM / AUDIO CAPE V0 / DESIGNED BY HAYDEN RIDDIFORD